# EAGLE design Audio-Sound_Breakout-v10 (EAGLE 6.2)
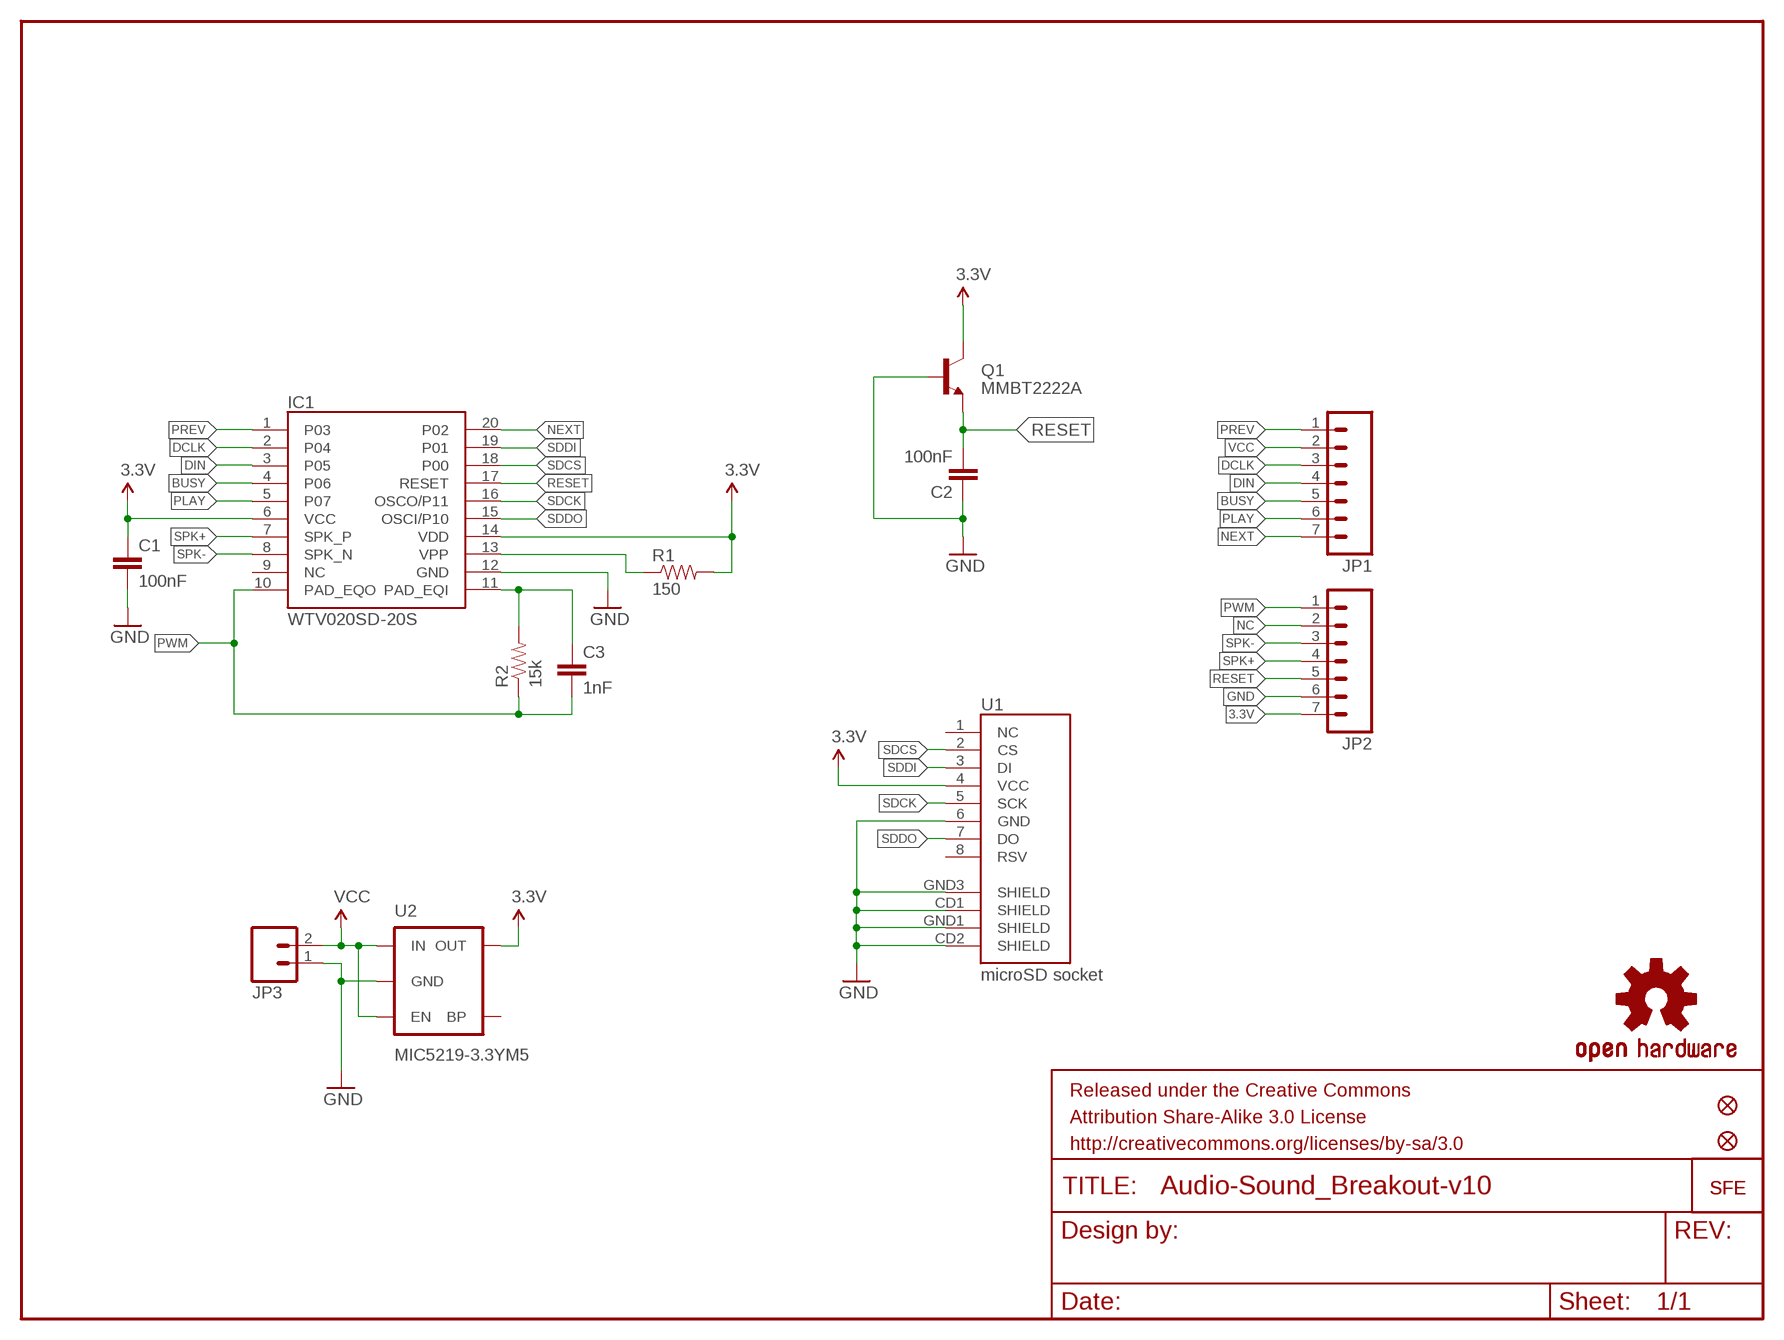
[diagram p0: schematic, sheet 1]

## Parts
C1  100nF  CAP0402-CAP  [0402-CAP]
C2  100nF  CAP0402-CAP  [0402-CAP]
C3  1nF  CAP0402-CAP  [0402-CAP]
IC1  WTV020SD-20S  WTV020SD  [SSOP_20]
JP1  M07  [1X07]
JP2  M07  [1X07]
JP3  M02-JST-2MM-SMT  [JST-2-SMD]
JP4  LOGO-SFENW2  [SFE-NEW-WEB]
JP5  LOGO-SFENEW  [SFE-NEW-WEBLOGO]
JP6  FIDUCIALUFIDUCIAL  [MICRO-FIDUCIAL]
JP7  FIDUCIALUFIDUCIAL  [MICRO-FIDUCIAL]
Q1  MMBT2222A  TRANSISTOR_NPNSOT23  [SOT23]
R1  150  RESISTOR0402-RES  [0402-RES]
R2  15k  RESISTOR0402-RES  [0402-RES]
U1  microSD socket  USD-SOCKETNEW  [MICRO-SD-SOCKET-PP]
U2  MIC5219-3.3YM5  V_REG_MIC5219SMD  [SOT23-5]
U$1  OSHW-LOGOS  [OSHW-LOGO-S]

## Nets
3.3V: C1.1 IC1.6(VCC) IC1.14(VDD) JP2.7 Q1.3(C) R1.2 U1.4(VCC) U2.5(OUT)
BUSY: IC1.4(P06) JP1.5
DCLK: IC1.2(P04) JP1.3
DIN: IC1.3(P05) JP1.4
GND: C1.2 C2.1 IC1.12(GND) JP2.6 JP3.1 Q1.1(B) U1.6(GND) U1.CD1(SHIELD) U1.CD2(SHIELD) U1.GND1(SHIELD) U1.GND3(SHIELD) U2.2(GND)
N$1: IC1.13(VPP) R1.1
N$2: C3.1 IC1.11(PAD_EQI) R2.2
NC: JP2.2
NEXT: IC1.20(P02) JP1.7
PLAY: IC1.5(P07) JP1.6
PREV: IC1.1(P03) JP1.1
PWM: C3.2 IC1.10(PAD_EQO) JP2.1 R2.1
RESET: C2.2 IC1.17(RESET) JP2.5 Q1.2(E)
SDCK: IC1.16(OSCO/P11) U1.5(SCK)
SDCS: IC1.18(P00) U1.2(CS)
SDDI: IC1.19(P01) U1.3(DI)
SDDO: IC1.15(OSCI/P10) U1.7(DO)
SPK+: IC1.7(SPK_P) JP2.4
SPK-: IC1.8(SPK_N) JP2.3
VCC: JP1.2 JP3.2 U2.1(IN) U2.3(EN)
Unconnected: IC1.9(NC) U1.1(NC) U1.8(RSV) U2.4(BP)

## Library data of the parts
C1 = SparkFun-Passives:CAP: Capacitor Standard 0603 ceramic capacitor, and 0.1" leaded capacitor.; PROD_ID: CAP-00810
C2 = SparkFun-Passives:CAP: Capacitor Standard 0603 ceramic capacitor, and 0.1" leaded capacitor.; MFG: Multiple; PROD_#: CAP-00810; SKU: NA; SPARKLE_ID: 918
C3 = SparkFun-Passives:CAP: Capacitor Standard 0603 ceramic capacitor, and 0.1" leaded capacitor.; PROD_ID: CAP-07886
IC1 = SparkFun-DigitalIC:WTV020SD: SD audio playback IC Can play back .wav or .ad4 files from an SD card SPI control or digital input trigger control available in SSOP-20 or DIP-20; PROD_#: NA; PROD_ID: IC-11012; SKU: NA; SPARKLE_ID: 6000
JP1 JP2 = SparkFun-Connectors:M07: Header 7 Standard 7-pin 0.1" header. Use with straight break away headers (SKU : PRT-00116), right angle break away headers (PRT-00553), swiss pins (PRT-00743), machine pins (PRT-00117), and female headers (PRT-00115). NOTES ON THE VARIANTS LOCK and LOCK_LONGPADS... This footprint was designed to help hold the alignment of a through-hole component (i.e. 7-pin header) while soldering it into place. You may notice that each hole has been shifted either up or down by 0.005 of an inch from it's more standard position (which is usually a perfectly straight line). This slight alteration caused the pins (the squares in the middle) to touch the edges of the holes. Because they are alternating, it causes a "brace" to hold the header in place. 0.005 has proven to be the perfect amount of "off-center" position when using our standard breakaway headers. Although looks a little odd when you look at the bare footprint, once you have a header in there, the alteration is very hard to notice. Also, if you push a header all the way into place, it is covered up entirely on the bottom side. This idea of altering the position of holes to aid alignment will be further integrated into the Sparkfun Library for other footprints. It can help hold any component with 3 or more connection pins.
JP3 = SparkFun-Connectors:M02: Header 2 Standard 2-pin 0.1" header. Use with straight break away headers (SKU : PRT-00116), right angle break away headers (PRT-00553), swiss pins (PRT-00743), machine pins (PRT-00117), and female headers (PRT-00115). Molex polarized connector foot print use with SKU : PRT-08233 with associated crimp pins and housings.; PROD_ID: CONN-08352
JP4 JP5 = SparkFun-Aesthetics:LOGO-SFE: Spark Fun Electronics PCB Logo This is the standard Spark Fun Electronics PCB logo.
JP6 JP7 = SparkFun:FIDUCIAL: Fiducial Alignment Points Various fiducial points for machine vision alignment.
Q1 = SparkFun-DiscreteSemi:TRANSISTOR_NPN: Generic NPN BJT. MMBT2222 is the common NPN we use. Double check against datasheet- not all devices are the same!; PROD_ID: TRANS-08049
R1 = SparkFun-Passives:RESISTOR: Resistor Basic schematic elements and footprints for 0603, 1206, and PTH resistors.; PROD_ID: RES-11028
R2 = SparkFun-Passives:RESISTOR: Resistor Basic schematic elements and footprints for 0603, 1206, and PTH resistors.; PROD_ID: RES-07854
U1 = SparkFun-Connectors:USD-SOCKET: microSD Socket Push-push type uSD socket. Schematic element and footprint production proven. Spark Fun Electronics SKU : PRT-00127. tDoc lines correctly indicate media card edge positions when inserting (unlocked, locked, depressed).; PROD_ID: CONN-07820
U2 = SparkFun-PowerIC:V_REG_MIC5219: V_REG MIC5219 Standard 500mA LDO voltage regulator in SOT-23 layout. Micrel part MIC5219. BP (by-pass) pin is used to lower output noise with 470pF cap, may be left open.; PROD_ID: VREG-09872
U$1 = SparkFun-Aesthetics:OSHW-LOGO: Open Source Hardware Logo This logo indicates the piece of hardware it is found on incorporates a OSHW license and/or adheres to the definition of open source hardware found here: http://freedomdefined.org/OSHW

## Board
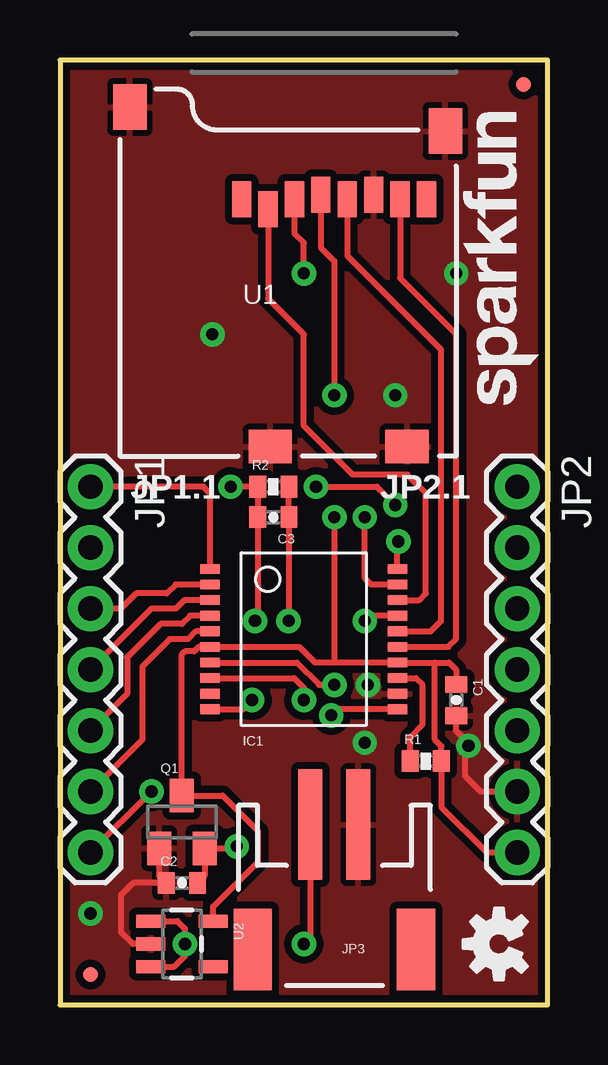
[diagram p1: board, top side]
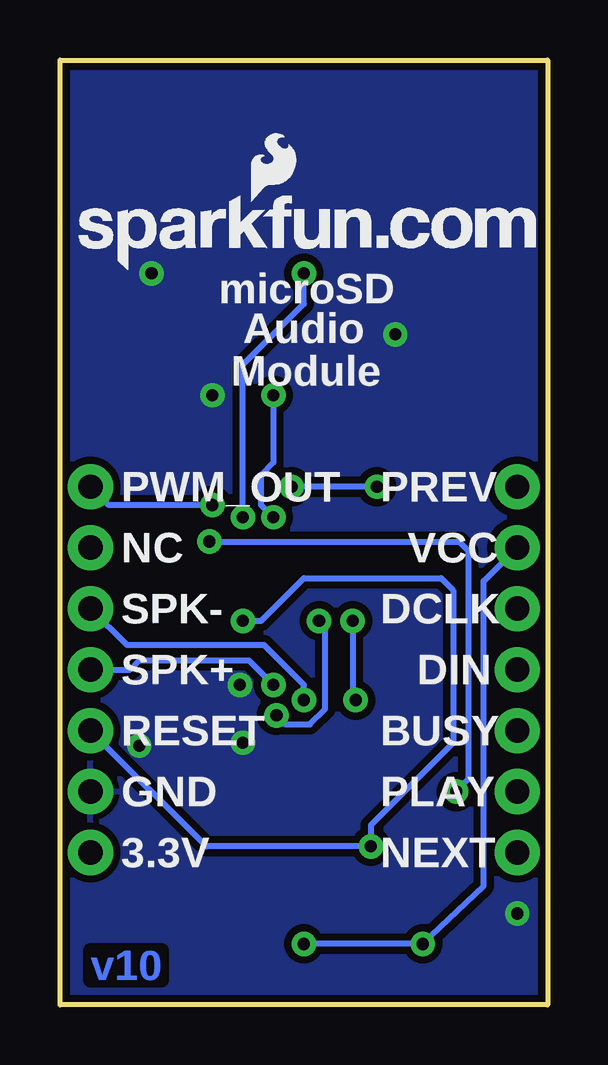
[diagram p2: board, bottom side, seen from below]

Size 20.32 x 39.37 mm. Coordinates in mm from the lower left corner, seen from the top.
Outline: 0,0 20.32,0 20.32,39.37 0,39.37 0,0
Copper layers (1*16): Top 0.035mm / dielectric 1.5mm / Bottom 0.035mm
Design rules: minimum track width 8mil, minimum drill 20mil, track to track 8mil, track to pad 8mil, pad to pad 8mil, via to via 8mil, smd to smd 8mil, copper to edge 8mil, drill to drill 8mil, minimum pad ring 12mil, minimum via ring 10mil, stop-mask expansion 4mil, vias tented up to drill 20mil, thermal gap 10mil

### Footprints (pad centres in the part's own frame; a part is rotated, then mirrored left to right if it is on the bottom)
0402-CAP = smd 0.7 x 0.9: 1 -0.65,0; 2 0.65,0
SSOP_20 = smd 0.813 x 0.406: 1 -3.9,2.925; 2 -3.9,2.275; 3 -3.9,1.625; 4 -3.9,0.975; 5 -3.9,0.325; 6 -3.9,-0.325; 7 -3.9,-0.975; 8 -3.9,-1.625; 9 -3.9,-2.275; 10 -3.9,-2.925; 11 3.9,-2.925; 12 3.9,-2.275; 13 3.9,-1.625; 14 3.9,-0.975; 15 3.9,-0.325; 16 3.9,0.325; 17 3.9,0.975; 18 3.9,1.625; 19 3.9,2.275; 20 3.9,2.925
1X07 = drill 1.016 pad 1.88: 1 0,0; 2 2.54,0; 3 5.08,0; 4 7.62,0; 5 10.16,0; 6 12.7,0; 7 15.24,0
JST-2-SMD = smd 1 x 4.6: 1 -1,-3.7; 2 1,-3.7 | smd 1.6 x 3.4: NC1 -3.4,1.5; NC2 3.4,1.5
MICRO-FIDUCIAL = smd 0.635 x 0.635: 1 0,0
SOT23 = smd 1 x 1.4: 1 -0.95,-1.1; 2 0.95,-1.1; 3 0,1.1
0402-RES = smd 0.7 x 0.9: 1 -0.65,0; 2 0.65,0
MICRO-SD-SOCKET-PP = smd 0.8 x 1.5: 1 -8.94,10.7; 2 -7.84,10.3; 3 -6.74,10.7; 4 -5.64,10.9; 5 -4.54,10.7; 6 -3.44,10.9; 7 -2.34,10.7; 8 -1.24,10.7 | smd 1.8 x 1.4: CD1 -2.05,0.4; CD2 -7.75,0.4 | smd 1.4 x 1.9: GND1 -13.6,14.55; GND3 -0.45,13.55
SOT23-5 = smd 0.55 x 1.2: 1 -0.95,-1.3; 2 0,-1.3; 3 0.95,-1.3; 4 0.95,1.3; 5 -0.95,1.3

### Placement (x,y rotation side)
C1  16.51,12.7 270 top
C2  5.08,5.08 0 top
C3  8.89,20.32 180 top
IC1  10.16,15.24 0 top
JP1  1.27,21.59 270 top
JP2  19.05,21.59 270 top
JP3  11.43,3.81 180 top
JP4  19.94,25.02 90 top
JP5  19.56,30.61 0 bottom
JP6  1.27,1.27 0 top
JP7  19.3,38.35 0 top
Q1  5.08,7.62 0 top
R1  15.24,10.16 0 top
R2  8.89,21.59 0 top
U1  16.51,22.86 0 top
U2  5.08,2.54 270 top
U$1  18.29,2.54 90 top

### Tracks (layer width: path | path; a pad name or v marks a point on that pad's centre or on a via)
3.3V  (via drill 0.51)
  Top 0.254: 15.62,14.27 IC1.14 11.43,14.27 | 15.62,14.27 16.21,14.27 16.51,13.97 C1.1 | 15.62,14.27 15.62,11.05 15.89,10.78 R1.2 15.89,8.24 17.78,6.35 JP2.7 | 11.43,14.27 10.63,14.27 9.98,14.91 IC1.6 5.77,14.91 5.59,14.73 5.21,14.73 5.08,14.61 Q1.3 6.77,8.72 8.26,7.24 8.26,5.97 6.38,4.09 U2.5 | U1.4 10.87,31.55 11.43,30.99 v11.43,25.4 | v11.43,20.32 11.43,14.27
  Bottom 0.254: v11.43,25.4 11.43,22.61 11.94,22.1 11.94,20.83 v11.43,20.32
BUSY
  Top 0.254: IC1.4 5.42,16.21 5.08,15.88 4.19,15.88 2.79,14.48 2.79,12.95 JP1.5
DCLK
  Top 0.254: IC1.2 4.82,17.52 4.45,17.14 3.17,17.14 2.54,16.51 JP1.3
DIN
  Top 0.254: IC1.3 5.18,16.86 4.83,16.51 3.81,16.51 JP1.4
GND  (via drill 0.51)
  Top 0.254: Q1.1 4.13,5.38 C2.1 3.05,5.08 2.54,4.57 2.54,3.05 3.05,2.54 U2.2 | JP2.6 17.53,8.89 16.89,9.53 16.89,11.05 16.51,11.43 C1.2
  other vias: 16.51,30.48 13.97,25.4 6.35,27.94 1.27,3.81 12.83,13.34 12.7,10.92 17.02,10.79
  pour Bottom (isolate 0.305): 0,39.37 20.32,39.37 20.32,0 0,0
  pour Top (isolate 0.305): 0,39.37 20.32,39.37 20.32,0 0,0
N$1
  Top 0.254: IC1.13 14.83,13.62 15.11,13.34 15.11,11.68 14.59,11.16 R1.1
N$2  (via drill 0.51)
  Top 0.254: IC1.11 11.55,12.31 v11.3,12.06 | R2.2 C3.1 9.54,16.02 v9.53,16
  Bottom 0.254: v11.3,12.06 10.92,11.68 9.91,11.68 9.27,12.32 9.27,15.62 9.53,15.88 v9.53,16
NEXT  (via drill 0.51)
  Top 0.254: IC1.20 14.06,19.27 v14.1,19.3 | v3.81,8.89 JP1.7
  Bottom 0.254: v14.1,19.3 3.68,19.3 3.3,18.92 3.3,9.4 v3.81,8.89
PLAY
  Top 0.254: IC1.5 5.66,15.56 5.33,15.24 4.57,15.24 3.43,14.1 3.43,11.05 JP1.6
PREV
  Top 0.254: IC1.1 6.26,21.3 5.97,21.59 JP1.1
PWM  (via drill 0.51)
  Top 0.254: v8.13,16 8.24,16.11 C3.2 R2.1 v7.11,21.59 | IC1.10 7.62,12.31 v8,12.7 | v10.67,21.59 13.21,21.59 v13.97,20.83
  Bottom 0.254: v8.13,16 8.13,12.83 v8,12.7 | v7.11,21.59 v10.67,21.59 | v13.97,20.83 18.29,20.83 JP2.1
RESET  (via drill 0.51)
  Top 0.254: C2.2 6.03,5.38 Q1.2 7.28,6.52 v7.37,6.6 | IC1.17 12.91,16.21 v12.7,16
  Bottom 0.254: v12.7,16 11.94,16 10.16,17.78 4.45,17.78 3.94,17.27 3.94,10.92 7.37,7.49 v7.37,6.6 14.22,6.6 JP2.5
SDCK
  Top 0.254: IC1.16 15.44,15.56 15.88,16 15.88,27.3 11.97,31.21 U1.5
SDCS
  Top 0.254: IC1.18 14.96,16.86 15.24,17.14 15.24,21.34 14.48,22.1 12.19,22.1 10.16,24.13 10.16,27.94 8.67,29.43 U1.2
SDDI  (via drill 0.51)
  Top 0.254: IC1.19 12.96,17.52 12.7,17.78 v12.7,20.32 | v10.16,30.48 10.16,31.75 9.77,32.14 U1.3
  Bottom 0.254: v12.7,20.32 12.7,26.67 10.16,29.21 v10.16,30.48
SDDO
  Top 0.254: IC1.15 16.18,14.91 16.51,15.24 16.51,27.94 14.17,30.28 U1.7
SPK+  (via drill 0.51)
  Top 0.254: IC1.7 9.87,14.27 10.79,13.34 v11.43,13.34
  Bottom 0.254: JP2.4 17.4,13.97 17.02,14.35 12.45,14.35 v11.43,13.34
SPK-  (via drill 0.51)
  Top 0.254: IC1.8 9.75,13.62 10.16,13.21 v10.16,12.7
  Bottom 0.254: v10.16,12.7 10.16,13.34 11.81,14.99 17.53,14.99 JP2.3
VCC  (via drill 0.51)
  Top 0.254: U2.1 4.89,3.49 5.21,3.17 v5.21,2.54 5.21,2.03 4.76,1.59 U2.3 | JP3.2 10.43,2.81 v10.16,2.54
  Bottom 0.254: v10.16,2.54 v5.21,2.54 2.67,4.95 2.67,17.65 JP1.2

### Text on the board
Bottom: v10
tPlace: JP1.1 | JP2.1
bPlace: microSD | Audio | Module | PREV | PWM_OUT | VCC | NC | DCLK | SPK- | DIN | SPK+ | BUSY | RESET | PLAY | GND | NEXT | 3.3V